# Altium schematic sheet Analog_Switch_Array_and_ZIF_ socket.SchDoc
size 431 x 279 mm; Organization: ORGANIZATION; Address1: ADDRESS 1; Address2: ADDRESS 2; Address3: ADDRESS 3; Address4: ADDRESS 4; Revision: -; SheetNumber: 3; SheetTotal: 4; ENG_APP_DATE: --/--/--; DSN_APP_DATE: --/--/--; CHK_APP_DATE: --/--/--
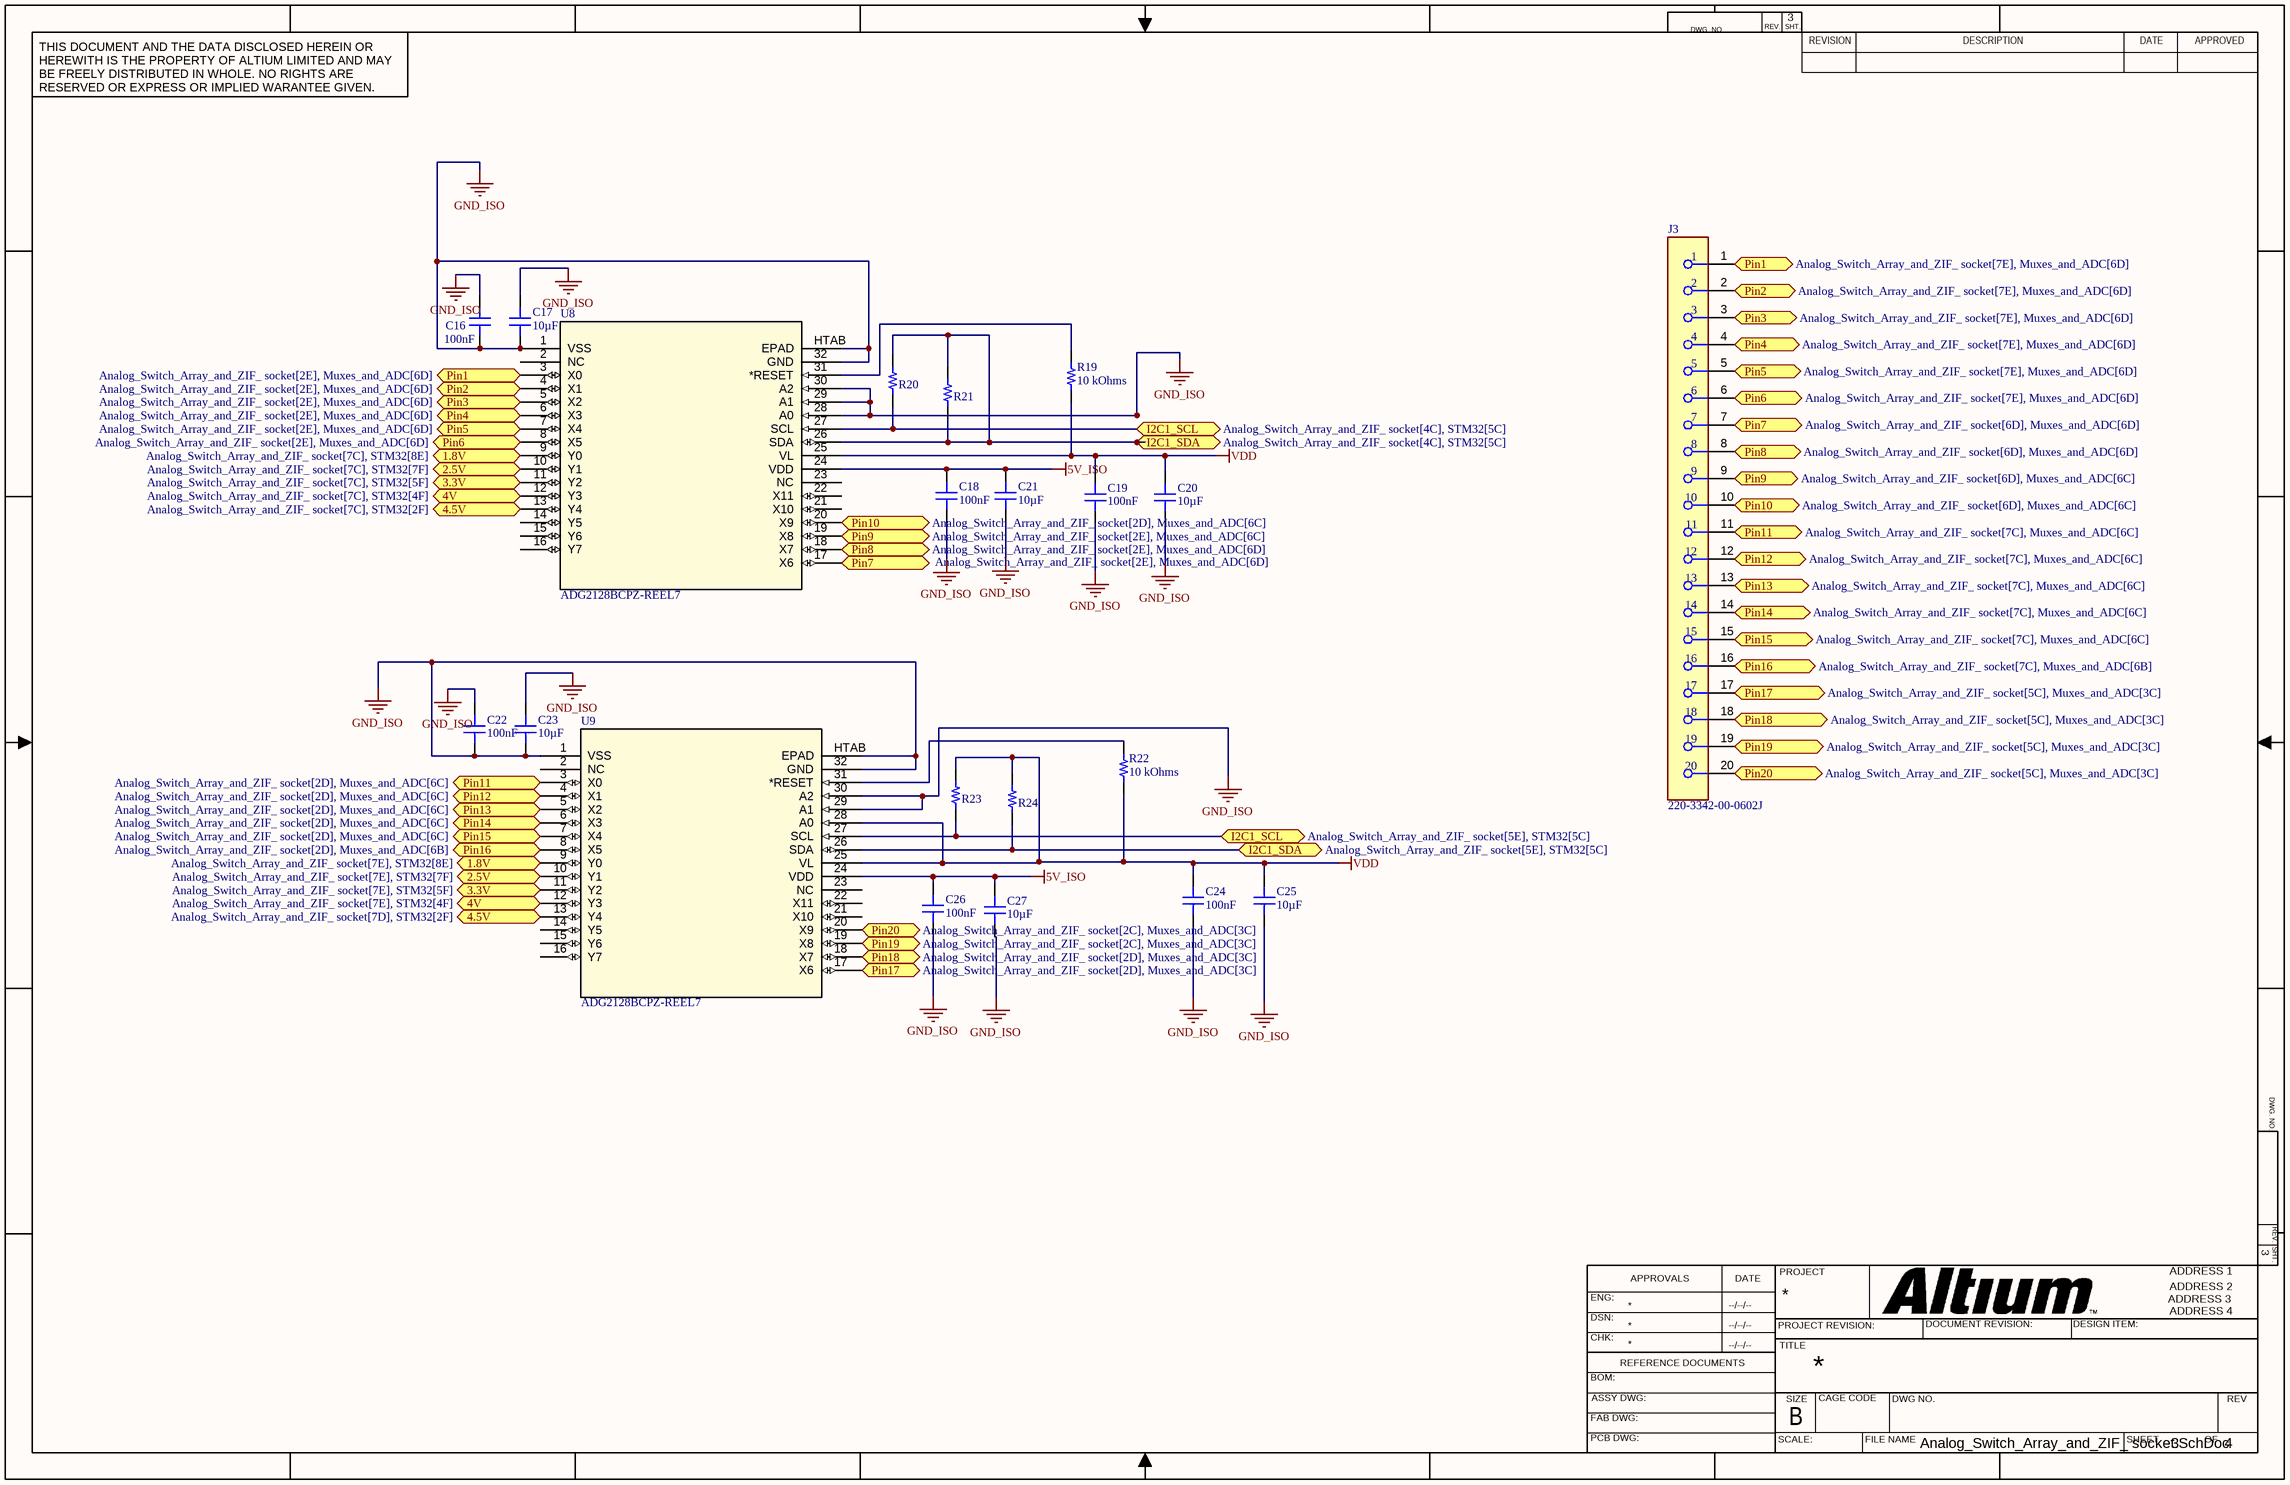
[diagram p0: Analog_Switch_Array_and_ZIF_ socket.SchDoc]

## Parts
C16  value 100nF  [CAP 1206_3216 - 0.8MM]  (hidden comment: C1206X104G4HAC7800)
C17  value 10µF  [CAP 0603_1608]  (hidden comment: KGM15CR51A106MM)
C18  value 100nF  [CAP 1206_3216 - 0.8MM]  (hidden comment: C1206X104G4HAC7800)
C19  value 100nF  [CAP 1206_3216 - 0.8MM]  (hidden comment: C1206X104G4HAC7800)
C20  value 10µF  [CAP 0603_1608]  (hidden comment: KGM15CR51A106MM)
C21  value 10µF  [CAP 0603_1608]  (hidden comment: KGM15CR51A106MM)
C22  value 100nF  [CAP 1206_3216 - 0.8MM]  (hidden comment: C1206X104G4HAC7800)
C23  value 10µF  [CAP 0603_1608]  (hidden comment: KGM15CR51A106MM)
C24  value 100nF  [CAP 1206_3216 - 0.8MM]  (hidden comment: C1206X104G4HAC7800)
C25  value 10µF  [CAP 0603_1608]  (hidden comment: KGM15CR51A106MM)
C26  value 100nF  [CAP 1206_3216 - 0.8MM]  (hidden comment: C1206X104G4HAC7800)
C27  value 10µF  [CAP 0603_1608]  (hidden comment: KGM15CR51A106MM)
J3  220-3342-00-0602J  [FP-220-3342-00-0602J-0]
R19  value 10 kOhms  [RES 0402_1005]  (hidden comment: RP73PF1E10KBTDF)
R20  SG732ETTD222K  [RES 1210_3225]  (value not drawn)
R21  SG732ETTD222K  [RES 1210_3225]  (value not drawn)
R22  value 10 kOhms  [RES 0402_1005]  (hidden comment: RP73PF1E10KBTDF)
R23  SG732ETTD222K  [RES 1210_3225]  (value not drawn)
R24  SG732ETTD222K  [RES 1210_3225]  (value not drawn)
U8  ADG2128BCPZ-REEL7  [CP_32_7_ADI]
U9  ADG2128BCPZ-REEL7  [CP_32_7_ADI]

## Ports
1.8V (bidir, see Analog_Switch_Array_and_ZIF_ socket[7C], STM32[8E]), 1.8V (bidir, see Analog_Switch_Array_and_ZIF_ socket[7E], STM32[8E]), 2.5V (bidir, see Analog_Switch_Array_and_ZIF_ socket[7C], STM32[7F]), 2.5V (bidir, see Analog_Switch_Array_and_ZIF_ socket[7E], STM32[7F]), 3.3V (bidir, see Analog_Switch_Array_and_ZIF_ socket[7C], STM32[5F]), 3.3V (bidir, see Analog_Switch_Array_and_ZIF_ socket[7E], STM32[5F]), 4.5V (bidir, see Analog_Switch_Array_and_ZIF_ socket[7C], STM32[2F]), 4.5V (bidir, see Analog_Switch_Array_and_ZIF_ socket[7D], STM32[2F]), 4V (bidir, see Analog_Switch_Array_and_ZIF_ socket[7C], STM32[4F]), 4V (bidir, see Analog_Switch_Array_and_ZIF_ socket[7E], STM32[4F]), I2C1_SCL (bidir, see Analog_Switch_Array_and_ZIF_ socket[4C], STM32[5C]), I2C1_SCL (bidir, see Analog_Switch_Array_and_ZIF_ socket[5E], STM32[5C]), I2C1_SDA (bidir, see Analog_Switch_Array_and_ZIF_ socket[4C], STM32[5C]), I2C1_SDA (bidir, see Analog_Switch_Array_and_ZIF_ socket[5E], STM32[5C]), Pin1 (bidir, see Analog_Switch_Array_and_ZIF_ socket[2E], Muxes_and_ADC[6D]), Pin1 (bidir, see Analog_Switch_Array_and_ZIF_ socket[7E], Muxes_and_ADC[6D]), Pin2 (bidir, see Analog_Switch_Array_and_ZIF_ socket[2E], Muxes_and_ADC[6D]), Pin2 (bidir, see Analog_Switch_Array_and_ZIF_ socket[7E], Muxes_and_ADC[6D]), Pin3 (bidir, see Analog_Switch_Array_and_ZIF_ socket[2E], Muxes_and_ADC[6D]), Pin3 (bidir, see Analog_Switch_Array_and_ZIF_ socket[7E], Muxes_and_ADC[6D]), Pin4 (bidir, see Analog_Switch_Array_and_ZIF_ socket[2E], Muxes_and_ADC[6D]), Pin4 (bidir, see Analog_Switch_Array_and_ZIF_ socket[7E], Muxes_and_ADC[6D]), Pin5 (bidir, see Analog_Switch_Array_and_ZIF_ socket[2E], Muxes_and_ADC[6D]), Pin5 (bidir, see Analog_Switch_Array_and_ZIF_ socket[7E], Muxes_and_ADC[6D]), Pin6 (bidir, see Analog_Switch_Array_and_ZIF_ socket[2E], Muxes_and_ADC[6D]), Pin6 (bidir, see Analog_Switch_Array_and_ZIF_ socket[7E], Muxes_and_ADC[6D]), Pin7 (bidir, see Analog_Switch_Array_and_ZIF_ socket[2E], Muxes_and_ADC[6D]), Pin7 (bidir, see Analog_Switch_Array_and_ZIF_ socket[6D], Muxes_and_ADC[6D]), Pin8 (bidir, see Analog_Switch_Array_and_ZIF_ socket[2E], Muxes_and_ADC[6D]), Pin8 (bidir, see Analog_Switch_Array_and_ZIF_ socket[6D], Muxes_and_ADC[6D]), Pin9 (bidir, see Analog_Switch_Array_and_ZIF_ socket[2E], Muxes_and_ADC[6C]), Pin9 (bidir, see Analog_Switch_Array_and_ZIF_ socket[6D], Muxes_and_ADC[6C]), Pin10 (bidir, see Analog_Switch_Array_and_ZIF_ socket[2D], Muxes_and_ADC[6C]), Pin10 (bidir, see Analog_Switch_Array_and_ZIF_ socket[6D], Muxes_and_ADC[6C]), Pin11 (bidir, see Analog_Switch_Array_and_ZIF_ socket[2D], Muxes_and_ADC[6C]), Pin11 (bidir, see Analog_Switch_Array_and_ZIF_ socket[7C], Muxes_and_ADC[6C]), Pin12 (bidir, see Analog_Switch_Array_and_ZIF_ socket[2D], Muxes_and_ADC[6C]), Pin12 (bidir, see Analog_Switch_Array_and_ZIF_ socket[7C], Muxes_and_ADC[6C]), Pin13 (bidir, see Analog_Switch_Array_and_ZIF_ socket[2D], Muxes_and_ADC[6C]), Pin13 (bidir, see Analog_Switch_Array_and_ZIF_ socket[7C], Muxes_and_ADC[6C]), Pin14 (bidir, see Analog_Switch_Array_and_ZIF_ socket[2D], Muxes_and_ADC[6C]), Pin14 (bidir, see Analog_Switch_Array_and_ZIF_ socket[7C], Muxes_and_ADC[6C]), Pin15 (bidir, see Analog_Switch_Array_and_ZIF_ socket[2D], Muxes_and_ADC[6C]), Pin15 (bidir, see Analog_Switch_Array_and_ZIF_ socket[7C], Muxes_and_ADC[6C]), Pin16 (bidir, see Analog_Switch_Array_and_ZIF_ socket[2D], Muxes_and_ADC[6B]), Pin16 (bidir, see Analog_Switch_Array_and_ZIF_ socket[7C], Muxes_and_ADC[6B]), Pin17 (bidir, see Analog_Switch_Array_and_ZIF_ socket[2D], Muxes_and_ADC[3C]), Pin17 (bidir, see Analog_Switch_Array_and_ZIF_ socket[5C], Muxes_and_ADC[3C]), Pin18 (bidir, see Analog_Switch_Array_and_ZIF_ socket[2D], Muxes_and_ADC[3C]), Pin18 (bidir, see Analog_Switch_Array_and_ZIF_ socket[5C], Muxes_and_ADC[3C]), Pin19 (bidir, see Analog_Switch_Array_and_ZIF_ socket[2C], Muxes_and_ADC[3C]), Pin19 (bidir, see Analog_Switch_Array_and_ZIF_ socket[5C], Muxes_and_ADC[3C]), Pin20 (bidir, see Analog_Switch_Array_and_ZIF_ socket[2C], Muxes_and_ADC[3C]), Pin20 (bidir, see Analog_Switch_Array_and_ZIF_ socket[5C], Muxes_and_ADC[3C])

## Nets
5V_ISO: C18.2 C21.2 C26.2 C27.2 U8.24(VDD) U9.24(VDD)
GND_ISO: C16.1 C16.2 C17.1 C17.2 C18.1 C19.1 C20.1 C21.1 C22.1 C22.2 C23.1 C23.2 C24.1 C25.1 C26.1 C27.1 U8.1(VSS) U8.28(A0) U8.29(A1) U8.30(A2) U8.32(GND) U8.HTAB(EPAD) U9.1(VSS) U9.29(A1) U9.30(A2) U9.32(GND) U9.HTAB(EPAD)
VDD: C19.2 C20.2 C24.2 C25.2 R19.2 R22.2 R23.2 R24.2 U8.25(VL) U9.25(VL) U9.28(A0)
1.8V: U8.9(Y0) U9.9(Y0) ; port 1.8V
2.5V: U8.10(Y1) U9.10(Y1) ; port 2.5V
3.3V: U8.11(Y2) U9.11(Y2) ; port 3.3V
4.5V: U8.13(Y4) U9.13(Y4) ; port 4.5V
4V: U8.12(Y3) U9.12(Y3) ; port 4V
I2C1_SCL: R20.1 R23.1 U8.27(SCL) U9.27(SCL) ; port I2C1_SCL
I2C1_SDA: R20.2 R21.1 R21.2 R24.1 U8.26(SDA) U9.26(SDA) ; port I2C1_SDA
Pin1: J3.1 U8.3(X0) ; port Pin1
Pin2: J3.2 U8.4(X1) ; port Pin2
Pin3: J3.3 U8.5(X2) ; port Pin3
Pin4: J3.4 U8.6(X3) ; port Pin4
Pin5: J3.5 U8.7(X4) ; port Pin5
Pin6: J3.6 U8.8(X5) ; port Pin6
Pin7: J3.7 U8.17(X6) ; port Pin7
Pin8: J3.8 U8.18(X7) ; port Pin8
Pin9: J3.9 U8.19(X8) ; port Pin9
Pin10: J3.10 U8.20(X9) ; port Pin10
Pin11: J3.11 U9.3(X0) ; port Pin11
Pin12: J3.12 U9.4(X1) ; port Pin12
Pin13: J3.13 U9.5(X2) ; port Pin13
Pin14: J3.14 U9.6(X3) ; port Pin14
Pin15: J3.15 U9.7(X4) ; port Pin15
Pin16: J3.16 U9.8(X5) ; port Pin16
Pin17: J3.17 U9.17(X6) ; port Pin17
Pin18: J3.18 U9.18(X7) ; port Pin18
Pin19: J3.19 U9.19(X8) ; port Pin19
Pin20: J3.20 U9.20(X9) ; port Pin20
NetR19_1: R19.1 U8.31(*RESET)
NetR22_1: R22.1 U9.31(*RESET)

Not connected (* = marked no-connect by the designer): U8 2(NC) 14(Y5) 15(Y6) 16(Y7) 21(X10) 22(X11) 23(NC); U9 2(NC) 14(Y5) 15(Y6) 16(Y7) 21(X10) 22(X11) 23(NC)

## Notes on the sheet
- DWG. NO.
- REV.
- SHT.
- THIS DOCUMENT AND THE DATA DISCLOSED HEREIN OR HEREWITH IS THE PROPERTY OF ALTIUM LIMITED AND MAY BE FREELY DISTRIBUTED IN WHOLE. NO RIGHTS ARE RESERVED OR EXPRESS OR IMPLIED WARANTEE GIVEN.
- REVISION
- DESCRIPTION
- DATE
- APPROVED
- ENG:
- APPROVALS
- PROJECT
- DSN:
- CHK:
- REFERENCE DOCUMENTS
- PROJECT REVISION:
- TITLE
- DOCUMENT REVISION:
- DESIGN ITEM:
- BOM:
- FAB DWG:
- PCB DWG:
- ASSY DWG:
- SCALE:
- SIZE
- B
- CAGE CODE
- FILE NAME
- DWG NO.
- SHEET
- OF
- REV

## Library data of the parts
C16 C18 C19 C22 C24 C26 = CMP-001-063573-1: CAP CER 1206 0.1F 16V ULTRA STAB; Part Number: C1206X104G4HAC7800
C17 C20 C21 C23 C25 C27 = CMP-001-046966-1: CAP CER 10UF 10V X5R 0603; Part Number: KGM15CR51A106MM
J3 = CMP-05380-000001-1: CONN IC DIP SOCKET ZIF 20POS GLD; Manufacturer: 3M; Is Female: yes; Standoff Height: 0.38mm; Conn Orientation: Vertical; Number Of Contacts: 20; Conn Gender: Female; Socket Package: DIP20; Pitch: 2.54mm; Current Rating: 1A; Category: Conn; Temperature Range Low: -55°C; Package: 0; Device Class L3: unset; Temperature: -55°C to +125°C; Number Of Rows: 2; ComponentLink2Description: Datasheet; ComponentLink2URL: https://multimedia.3m.com/mws/media/494546O/3mtm-dip-sockets-100-2-54-mm-ts0365.pdf; Temperature Range High: +125°C; Digikey Description: CONN IC DIP SOCKET ZIF 20POS GLD; Mouser Description: IC & Component Sockets 0.100 DIP SOCKET 20 Contact Qty.; Manufacturer Part Number: 220-3342-00-0602J; Device Class L2: IC and Component Sockets; Octopart: https://octopart.com/220-3342-00-0602j-3m-108647; Device Class L1: Connectors; Contact Material: Gold,Nickel; Height: 24mm; Lead Free: Yes; RoHS: TRUE; Automotive: No
R19 R22 = CMP-009-026965-1: RES 10K OHM 0.1% 1/16W 0402; Part Number: RP73PF1E10KBTDF
R20 R21 R23 R24 = CMP-009-093445-1: RES 2.2K OHM 10% 1/2W 1210; Part Number: SG732ETTD222K
U8 U9 = CMP-011-00018-1: I2C CMOS 8 X 12 Analog Switch Array with Dual/Single Supplies; Manufacturer_Name: Analog Devices Inc; Manufacturer_Part_Number: ADG2128BCPZ-REEL7; Component Type: Standard; Source: ADG2128BCPZ-REEL7.SchLib; Type: Type; Pins: 33; RefDes: RefDes; Copyright: Copyright (C) 2025 Ultra Librarian. All rights reserved.; Design Item ID: ADG2128BCPZ-REEL7